# EAGLE design Pithy Dial (EAGLE 9.6.2)
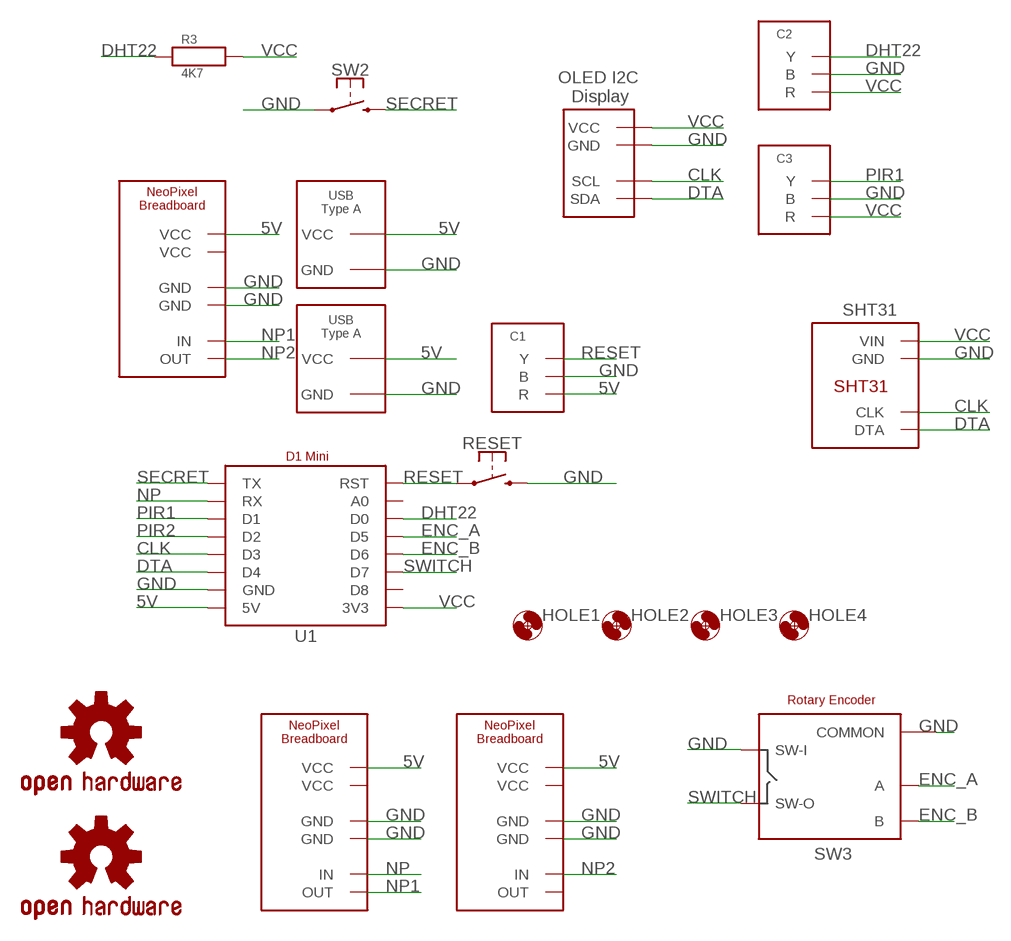
[diagram p0: schematic, sheet 1]

## Parts
C1  JST_2MM_3PIN  [JST_2MM_3PIN]
C2  JST_2MM_3PIN  [JST_2MM_3PIN]
C3  JST_2MM_3PIN  [JST_2MM_3PIN]
HOLE1  HOLE_3.2  [HOLE_3.2]
HOLE2  HOLE_3.2  [HOLE_3.2]
HOLE3  HOLE_3.2  [HOLE_3.2]
HOLE4  HOLE_3.2  [HOLE_3.2]
LOGO1  OSHW-LOGOM  [OSHW-LOGO-M]
LOGO2  OSHW-LOGOS  [OSHW-LOGO-S]
NP1  NEOPIXEL_BREADBOARD  [NEOPIXEL_BREADBOARD]
NP2  LEFT_NEOPIXEL  NEOPIXEL_BREADBOARD  [NEOPIXEL_BREADBOARD]
NP3  RIGHT_NEOPIXEL  NEOPIXEL_BREADBOARD  [NEOPIXEL_BREADBOARD]
R3  4K7  1/4W_RESISTOR  [1/4W_RESISTOR]
RESET  SPDT_MOMENTARY  [SPDT_RIGHT_ANGLE]
SHT31  SHT31RIGHT_ANGLED  [SHT31_RIGHT_ANGLE]
SW2  SPDT_MOMENTARY  [SPDT_RIGHT_ANGLE]
SW3  ENCODER  ROTARY_ENCODER  [ROTARY_ENCODER]
U1  D1_MINI  [D1_MINI]
U2  OLED_I2C_0.9"VCC_LEFT  [OLED_I2C_0.9"_ALT]
U$1  USB_TYPE_A  [USB_TYPE_A_BACKWARDS]
U$3  USB_TYPE_A  [USB_TYPE_A_BACKWARDS]

## Nets
5V [power]: C1.RED(R) NP1.VCC NP2.VCC NP3.VCC U1.5V U$1.VCC U$3.VCC
CLK: SHT31.CLK U1.D3 U2.SCL
DHT22: C2.YELLOW(Y) R3.P$1 U1.D0
DTA: SHT31.DTA U1.D4 U2.SDA
ENC_A: SW3.A U1.D5
ENC_B: SW3.B U1.D6
GND: C1.BLACK(B) C2.BLACK(B) C3.BLACK(B) NP1.GND NP1.GND@2(GND) NP2.GND NP2.GND@2(GND) NP3.GND NP3.GND@2(GND) RESET.2 SHT31.GND SW2.1 SW3.C(COMMON) SW3.SW+(SW-I) U1.GND U2.GND U$1.GND U$3.GND
NP: NP2.IN U1.RX
NP1: NP1.IN NP2.OUT
NP2: NP1.OUT NP3.IN
PIR1: C3.YELLOW(Y) U1.D1
PIR2: U1.D2
RESET: C1.YELLOW(Y) RESET.1 U1.RST
SECRET: SW2.2 U1.TX
SWITCH: SW3.SW-(SW-O) U1.D7
VCC [3v3]: C2.RED(R) C3.RED(R) R3.P$2 SHT31.VIN U1.3V3 U2.VCC
Unconnected: NP1.VCC@2(VCC) NP2.VCC@2(VCC) NP3.OUT NP3.VCC@2(VCC) U1.A0 U1.D8

## Library data of the parts
C1-C3 = ioios:JST_2MM_3PIN
HOLE1-HOLE4 = ioios:HOLE_3.2
LOGO1 LOGO2 = ioios:OSHW-LOGO: Open-Source Hardware (OSHW) Logo This logo indicates the piece of hardware it is found on incorporates a OSHW license and/or adheres to the definition of open source hardware found here: http://freedomdefined.org/OSHW
NP1-NP3 = ioios:NEOPIXEL_BREADBOARD
R3 = ioios:1/4W_RESISTOR
RESET SW2 = ioios:SPDT_MOMENTARY
SHT31 = ioios:SHT31
SW3 = JESP:ROTARY_ENCODER
U1 = ioios:D1_MINI
U2 = ioios:OLED_I2C_0.9"
U$1 U$3 = ioios:USB_TYPE_A

## Net classes
1 power: width 0.203 mm, clearance 0.254 mm
2 3v3: width 0.305 mm, drill 0.203 mm, clearance 0.254 mm

## Board
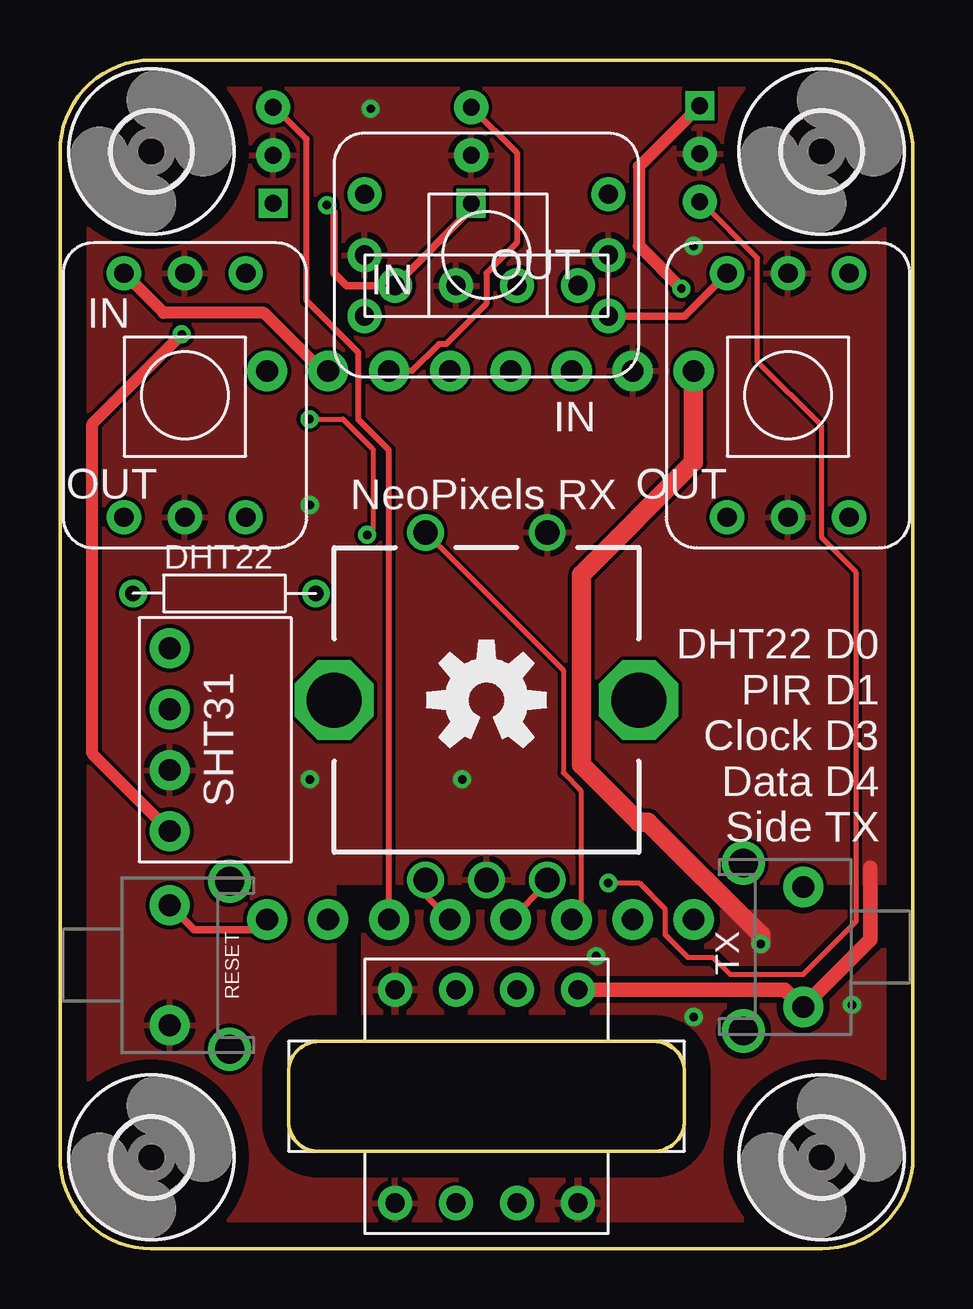
[diagram p1: board, top side]
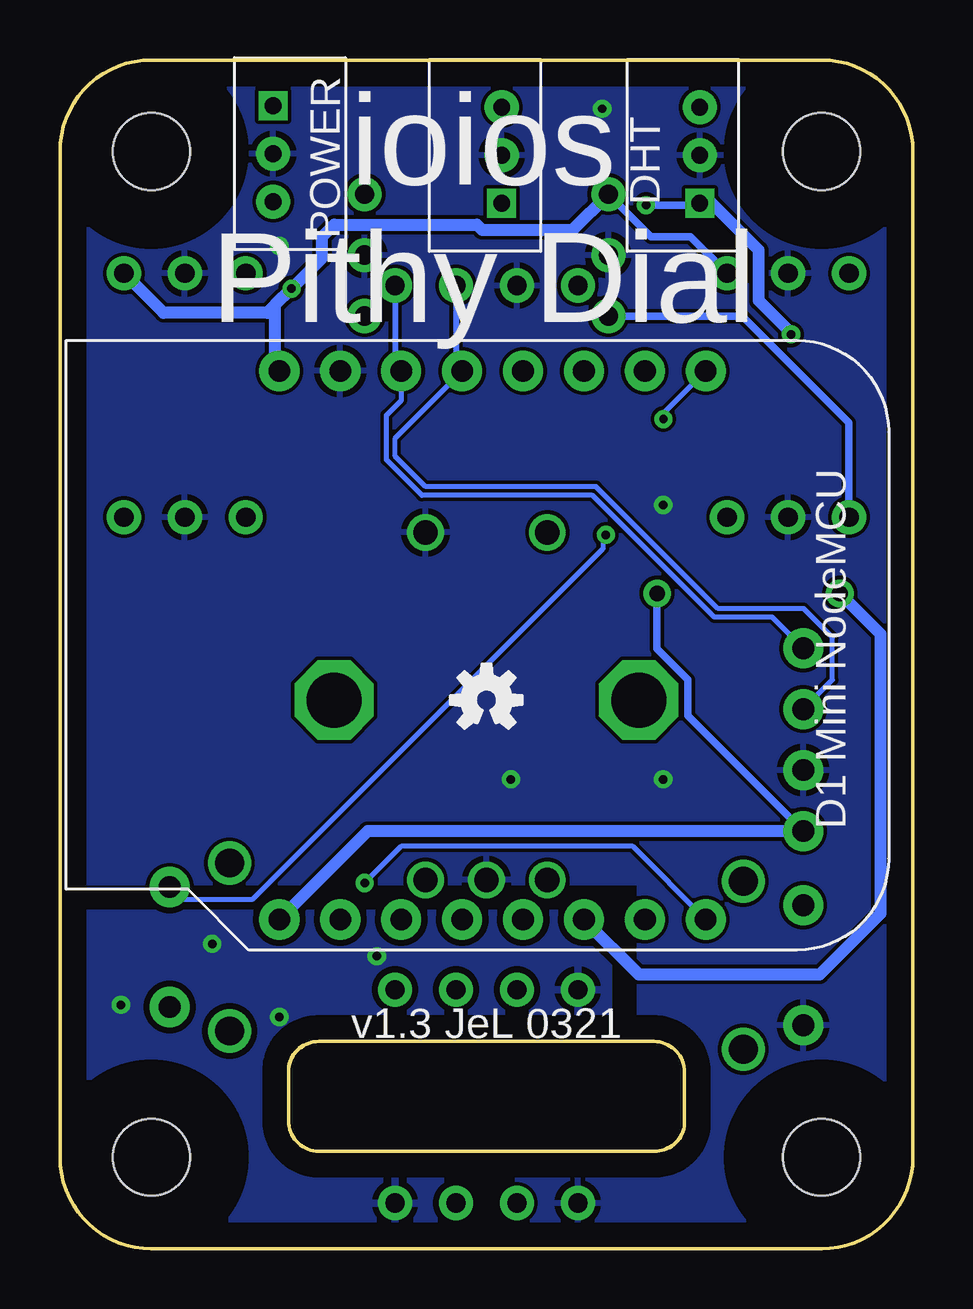
[diagram p2: board, bottom side, seen from below]

Size 35.56 x 49.53 mm. Coordinates in mm from the lower left corner, seen from the top.
Outline: 10.79,8.64 arc90 9.53,7.37 9.53,5.21 arc90 10.79,4.06 24.77,4.06 arc90 26.04,5.33 26.04,7.37 arc90 24.77,8.64 10.79,8.64
Outline: 0,45.72 0,3.81 arc90 3.81,0 31.75,0 arc90 35.56,3.81 35.56,45.72 arc90 31.75,49.53 3.81,49.53 arc90 0,45.72
Copper layers (1*16): Top 0.035mm / dielectric 1.53mm / Bottom 0.035mm
Design rules "default *": minimum track width 6mil, minimum drill 0.35mm, track to track 6mil, track to pad 6mil, pad to pad 6mil, via to via 6mil, smd to smd 6mil, copper to edge 40mil, drill to drill 6mil, minimum pad ring 10mil, minimum via ring 8mil, stop-mask expansion 4mil, vias tented up to drill 0mil, thermal gap 10mil

### Footprints (pad centres in the part's own frame; a part is rotated, then mirrored left to right if it is on the bottom)
JST_2MM_3PIN = drill 0.7 pad 1.422: BLACK 2,-0.508; YELLOW 4,-0.508 | drill 0.7 square: RED 0,-0.508
HOLE_3.2 = hole 3.2: 0,0
NEOPIXEL_BREADBOARD = drill 0.8 pad 1.422: GND 3.81,11.43; GND@2 3.81,1.27; IN 1.27,11.43; OUT 1.27,1.27; VCC 6.35,11.43; VCC@2 6.35,1.27
1/4W_RESISTOR = drill 0.65: P$1 -3.81,0; P$2 3.81,0
SPDT_RIGHT_ANGLE = drill 0.9 pad 1.676: 1 -2.5,0; 2 2.5,0 | drill 1.2 pad 1.676: ANCHOR1 -3.5,2.5; ANCHOR2 3.5,2.5
SHT31_RIGHT_ANGLE = drill 0.9 pad 1.676: CLK 5.08,0; DTA 7.62,0; GND 2.54,0; VIN 0,0
ROTARY_ENCODER = drill 1.016: A 7.493,-2.54; B 7.493,2.54; C 7.493,0; SW+ -6.985,2.54; SW- -6.985,-2.54 | drill 2.286 octagon: ANC1 0,6.35; ANC2 0,-6.35
D1_MINI = drill 0.9 pad 1.676: 3V3 24.13,8.89; 5V 1.27,8.89; A0 24.13,24.13; D0 24.13,21.59; D1 1.27,21.59; D2 1.27,19.05; D3 1.27,16.51; D4 1.27,13.97; D5 24.13,19.05; D6 24.13,16.51; D7 24.13,13.97; D8 24.13,11.43; GND 1.27,11.43; RST 24.13,26.67; RX 1.27,24.13; TX 1.27,26.67
OLED_I2C_0.9"_ALT = drill 0.8 pad 1.422: GND 2.54,0; SCL 5.08,0; SDA 7.62,0; VCC 0,0
USB_TYPE_A_BACKWARDS = drill 0.8 pad 1.422: GND 7.62,0; P$2 2.54,0; P$3 5.08,0; VCC 0,0

### Placement (x,y rotation side)
C1  26.16,47.62 270 bottom
C2  9.4,43.56 90 bottom
C3  17.65,43.56 90 bottom
HOLE1  3.81,3.81 0 top
HOLE2  3.81,45.72 0 top
HOLE3  31.75,3.81 0 top
HOLE4  31.75,45.72 0 top
LOGO1  17.78,22.86 0 top
LOGO2  17.78,22.86 0 bottom
NP1  24.13,37.59 90 top
NP2  1.4,29.21 0 top
NP3  26.54,29.21 0 top
R3  6.86,27.3 0 top
RESET  4.57,11.81 270 top
SHT31  4.57,17.4 90 top
SW2  30.99,12.57 90 top
SW3  17.78,22.86 270 top
U1  35.31,37.85 270 bottom
U2  13.97,40.13 0 top
U$1  13.97,10.79 0 top
U$3  21.59,1.91 180 top

### Tracks (layer width: path | path; a pad name or v marks a point on that pad's centre or on a via)
5V  (via drill 0.35)
  Top 0.508: C1.RED 24.13,45.09 24.13,41.78 v25.91,40.01
  Top 0.813: v29.21,12.7 29.21,13.08 24.51,17.78 24.13,17.78 21.74,20.17 21.74,28.09 26.42,32.77 U1.5V
  Bottom 0.305: NP2.VCC 9.27,42.16 10.92,42.16 NP1.VCC
  Bottom 0.508: 26.61,39.31 v25.91,40.01 24.64,41.27 24.64,42.16 24.13,42.67 18.18,42.67 17.96,42.45 14.19,42.45 NP1.VCC | 26.61,39.31 26.92,38.99 31.24,38.99 NP3.VCC | 26.61,39.31 26.61,36.77 U1.5V
  other vias: 33.02,10.16 26.42,9.65 22.35,12.19
  pour Top: 12.7,13.97 12.7,6.35 17.78,6.35 17.78,0 35.56,0 35.56,13.97
  pour Bottom: 12.7,6.35 12.7,13.97 35.56,13.97 35.56,0 17.78,0 17.78,6.35
CLK
  Bottom 0.203: SHT31.CLK 3.35,23.7 3.35,25.47 4.55,26.67 8.13,26.67 13.21,31.75 20.32,31.75 21.59,33.02 21.59,33.76 18.8,36.55 U1.D3
  Bottom 0.254: U2.SCL 19.05,36.83 U1.D3
DHT22
  Top 0.254: U1.D0 13.72,33.27 12.45,34.54 12.45,37.34 10.29,39.5 10.29,46.23 8.95,47.56 C2.YELLOW
  Bottom 0.508: U1.D0 11.43,11.43 3.89,11.43 1.35,13.97 1.35,25.6 R3.P$1
DTA
  Bottom 0.203: SHT31.DTA 5.87,26.31 8.28,26.31 13.36,31.39 20.47,31.39 21.95,32.87 21.95,34.73 21.34,35.34 U1.D4
  Bottom 0.254: U2.SDA 21.59,36.83 U1.D4
ENC_A
  Top 0.254: SW3.A 15.24,14.73 U1.D5
ENC_B
  Top 0.254: SW3.B 20.32,15.24 U1.D6
GND  (via drill 0.35)
  Top 0.61: 33.78,15.88 33.78,12.87 SW2.1 30.95,10.07 30.23,10.79 U$1.GND
  other vias: 10.41,30.99 26.42,41.78 16.76,19.56 10.41,19.56 12.95,47.5
  pour Top: 16.51,5.08 16.51,0 0,0 0,49.53 35.56,49.53 35.56,15.24 11.43,15.24 11.43,5.08
  pour Bottom: 16.51,5.08 16.51,0 0,0 0,49.53 35.56,49.53 35.56,15.24 11.43,15.24 11.43,5.08
NP
  Top 0.508: NP2.IN 4.32,38.99 8.51,38.99 10.92,36.58 U1.RX
NP1
  Bottom 0.305: NP2.OUT 2.67,34.42 7.11,38.86 NP1.IN
NP2
  Top 0.305: NP3.IN 26.04,38.86 NP1.OUT
PIR1
  Top 0.254: C3.YELLOW 19.05,45.66 19.05,41.91 17.78,40.64 17.78,39.37 16.1,37.69 15.79,37.69 14.68,36.58 U1.D1
RESET  (via drill 0.35)
  Top 0.2: v22.86,15.24 24.15,15.24 25.22,14.16 25.22,13.1 26.18,12.14 27.23,12.14 27.94,11.43 30.99,11.43 33.2,13.64 33.2,28.18 31.75,29.62 31.75,34.29 29.08,36.96 29.08,41.27 26.73,43.62 C1.YELLOW
  Top 0.305: U1.RST 8.21,13.29 5.59,13.29 RESET.1
  Bottom 0.2: U1.RST 11.68,16.76 21.34,16.76 v22.86,15.24
SECRET  (via drill 0.35)
  Top 0.2: v10.4,34.57 11.79,34.57 13.06,33.3 13.06,30 v12.8,29.75
  Bottom 0.2: SW2.2 30.48,14.56 27.52,14.56 12.92,29.17 12.92,29.63 v12.8,29.75 | v10.4,34.57 10.4,34.81 U1.TX
SWITCH
  Top 0.2: SW3.SW- 20.98,24.1 20.98,19.82 21.71,19.09 21.71,13.72 U1.D7
VCC  (via drill 0.35)
  Top 0.305: v11.13,43.48 11.43,43.18 11.43,40.64 11.94,40.13 U2.VCC 17.14,43.31 C3.RED
  Top 0.508: SHT31.VIN 1.35,20.62 1.35,34.37 v5.08,38.1
  Bottom 0.305: C2.RED 8.97,43.48 v11.13,43.48 | SHT31.VIN 9.37,22.2 9.37,23.71 10.67,25.01 R3.P$2
  Bottom 0.508: SHT31.VIN 22.73,17.4 U1.3V3 | v5.08,38.1 5.08,38.15 6.43,39.5 6.43,41.6 8.38,43.56 C2.RED

### Text on the board
bPlace: ioios / Pithy Dial | DHT | POWER | v1.3 JeL 0321
tNames: OUT | IN | IN | IN | OUT | OUT | NeoPixels RX | DHT22 | DHT22 D0 / PIR D1 / Clock D3 / Data D4 / Side TX | TX